# EAGLE design temt6000-v10 (EAGLE 6.2)
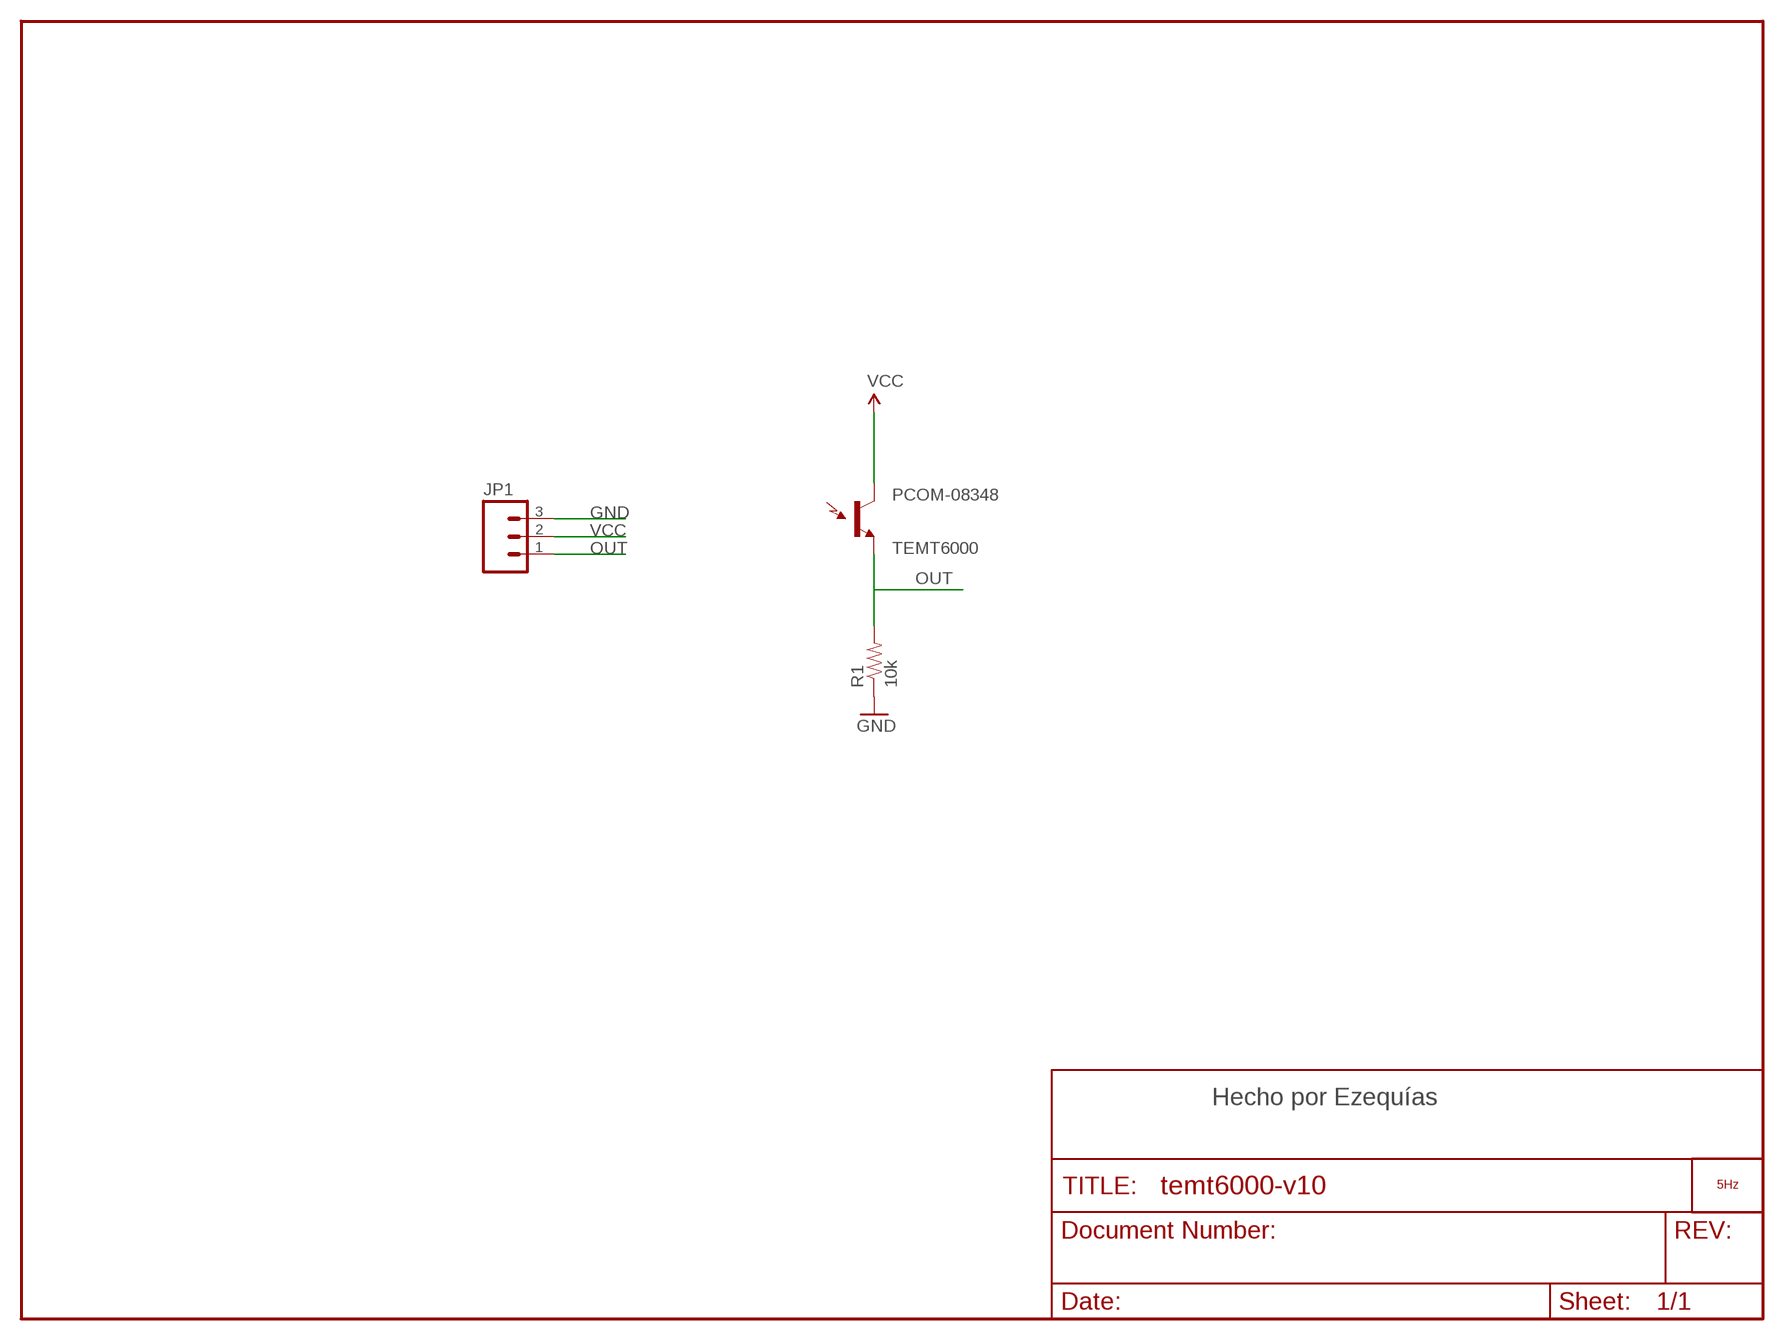
[diagram p0: schematic, sheet 1]

## Parts
JP1  M03PTH  [1X03]
LOGO1  LOGO_5HZ_H_5MM  [5HZ_LOGO_H_5MM]
PCOM-08348  TEMT6000  [TEMT6000-SEN]
R1  10k  RESISTOR0603-RES  [0603-RES]

## Nets
GND: JP1.3 R1.1
OUT: JP1.1 PCOM-08348.EMITTER(E1) R1.2
VCC: JP1.2 PCOM-08348.COLLECTOR(C1)

## Notes on the sheet
- Hecho por Ezequías

## Library data of the parts
JP1 = SparkFun:M03: Header 3 Standard 3-pin 0.1" header. Use with straight break away headers (SKU : PRT-00116), right angle break away headers (PRT-00553), swiss pins (PRT-00743), machine pins (PRT-00117), and female headers (PRT-00115). Molex polarized connector foot print use with SKU : PRT-08232 with associated crimp pins and housings.
LOGO1 = 5hz-electronica:LOGO_5HZ: Logotipo 5Hz "según Pedro"
PCOM-08348 = SparkFun:TEMT6000: Ambient Light Sensor Simple light detection sensor. Output varies with light intensity input. Spark Fun Electronics SKU : COM-08348
R1 = SparkFun:RESISTOR: Resistor Basic schematic elements and footprints for 0603, 1206, and PTH resistors.

## Net classes
0 default: width 0.203 mm
1 vcc: width 0.305 mm
2 gnd: width 0.254 mm

## Board
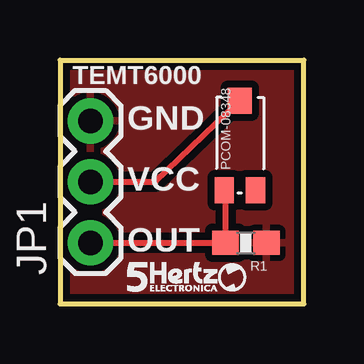
[diagram p1: board, top side]
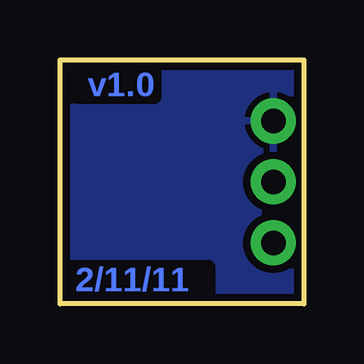
[diagram p2: board, bottom side, seen from below]

Size 10.16 x 10.16 mm. Coordinates in mm from the lower left corner, seen from the top.
Outline: 10.16,0 10.16,10.16 0,10.16 0,0 10.16,0
Copper layers (1*16): Top 0.035mm / dielectric 1.5mm / Bottom 0.035mm
Design rules: minimum track width 8mil, minimum drill 20mil, track to track 8mil, track to pad 8mil, pad to pad 8mil, via to via 8mil, smd to smd 8mil, copper to edge 10mil, drill to drill 8mil, minimum pad ring 12mil, minimum via ring 10mil, stop-mask expansion 4mil, vias tented up to drill 20mil, thermal gap 10mil

### Footprints (pad centres in the part's own frame; a part is rotated, then mirrored left to right if it is on the bottom)
1X03 = drill 1.016 pad 1.88: 1 0,0; 2 2.54,0; 3 5.08,0
TEMT6000-SEN = smd 1.1 x 0.8: BASE -1.87,-0.65; EMITTER -1.87,0.65 | smd 1.1 x 1: COLLECTOR 1.86,0.01
0603-RES = smd 1.1 x 1: 1 -0.85,0; 2 0.85,0

### Placement (x,y rotation side)
JP1  1.27,2.54 90 top
LOGO1  2.79,0.51 0 top
PCOM-08348  7.49,6.6 90 top
R1  7.75,2.54 180 top

### Tracks (layer width: path | path; a pad name or v marks a point on that pad's centre or on a via)
GND
  pour Bottom (isolate 0.305): 0,10.16 10.16,10.16 10.16,0 0,0
  pour Top (isolate 0.305): 0,10.16 10.16,10.16 10.16,0 0,0
OUT
  Top 0.254: JP1.1 R1.2 6.9,4.68 PCOM-08348.EMITTER
VCC
  Top 0.254: JP1.2 3.97,5.08 PCOM-08348.COLLECTOR

### Text on the board
Bottom: v1.0 | 2/11/11
tPlace: TEMT6000 | GND | VCC | OUT